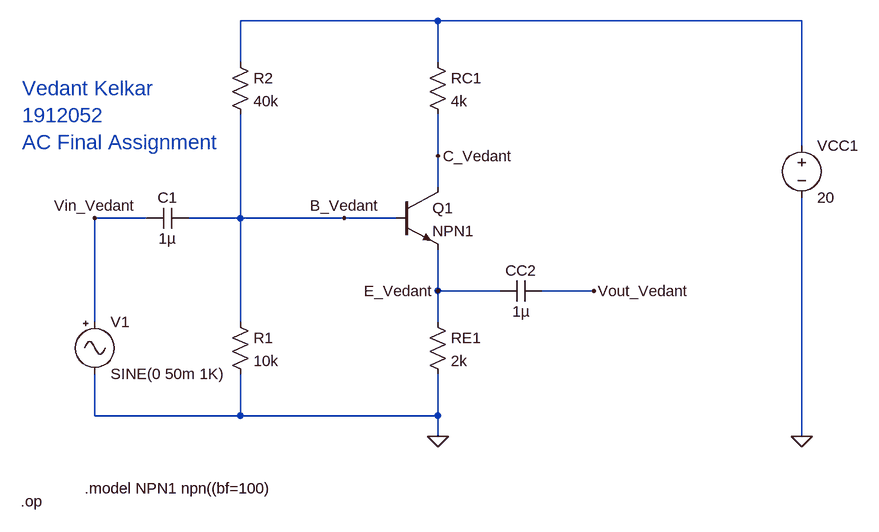
[diagram p0: schematic Draft39.asc]
Draft39.asc, the LTspice schematic file:
Version 4
SHEET 1 880 680
WIRE 96 -208 -208 -208
WIRE 656 -208 96 -208
WIRE -208 -144 -208 -208
WIRE 96 -144 96 -208
WIRE 656 -16 656 -208
WIRE 96 0 96 -64
WIRE 96 48 96 0
WIRE -352 96 -432 96
WIRE -208 96 -208 -64
WIRE -208 96 -288 96
WIRE -48 96 -208 96
WIRE 32 96 -48 96
WIRE 96 208 96 144
WIRE 192 208 96 208
WIRE 336 208 256 208
WIRE -432 256 -432 96
WIRE -208 256 -208 96
WIRE 96 256 96 208
WIRE -432 400 -432 336
WIRE -208 400 -208 336
WIRE -208 400 -432 400
WIRE 96 400 96 336
WIRE 96 400 -208 400
WIRE 96 432 96 400
WIRE 656 432 656 64
FLAG 96 0 C_Vedant
FLAG 96 208 E_Vedant
FLAG 656 432 0
FLAG 96 432 0
FLAG 336 208 Vout_Vedant
FLAG -48 96 B_Vedant
FLAG -432 96 Vin_Vedant
SYMBOL res -224 240 R0
SYMATTR InstName R1
SYMATTR Value 10k
SYMBOL res -224 -160 R0
SYMATTR InstName R2
SYMATTR Value 40k
SYMBOL res 80 240 R0
SYMATTR InstName RE1
SYMATTR Value 2k
SYMBOL res 80 -160 R0
SYMATTR InstName RC1
SYMATTR Value 4k
SYMBOL npn 32 48 R0
SYMATTR InstName Q1
SYMATTR Value NPN1
SYMBOL cap 256 192 R90
WINDOW 0 0 32 VBottom 2
WINDOW 3 32 32 VTop 2
SYMATTR InstName CC2
SYMATTR Value 1µ
SYMBOL voltage 656 -32 R0
WINDOW 123 0 0 Left 0
WINDOW 39 0 0 Left 0
SYMATTR InstName VCC1
SYMATTR Value 20
SYMBOL Misc\\signal -432 240 R0
WINDOW 123 0 0 Left 0
WINDOW 39 0 0 Left 0
SYMATTR InstName V1
SYMATTR Value SINE(0 50m 1K)
SYMBOL cap -288 80 R90
WINDOW 0 0 32 VBottom 2
WINDOW 3 32 32 VTop 2
SYMATTR InstName C1
SYMATTR Value 1µ
TEXT -448 512 Left 2 !.model NPN1 npn((bf=100)
TEXT -544 -104 Left 3 ;Vedant Kelkar \n1912052\nAC Final Assignment
TEXT -546 532 Left 2 !.op

The netlist it stands for:
* Draft39.asc
R1 B_Vedant 0 10k
R2 N001 B_Vedant 40k
RE1 E_Vedant 0 2k
RC1 N001 C_Vedant 4k
Q1 C_Vedant B_Vedant E_Vedant 0 NPN1
CC2 Vout_Vedant E_Vedant 1µ
VCC1 N001 0 20
V1 Vin_Vedant 0 SINE(0 50m 1K)
C1 B_Vedant Vin_Vedant 1µ
.model NPN NPN
.model PNP PNP
.lib standard.bjt
.model NPN1 npn((bf=100)
* Vedant Kelkar
* 1912052
* AC Final Assignment
.op
.backanno
.end